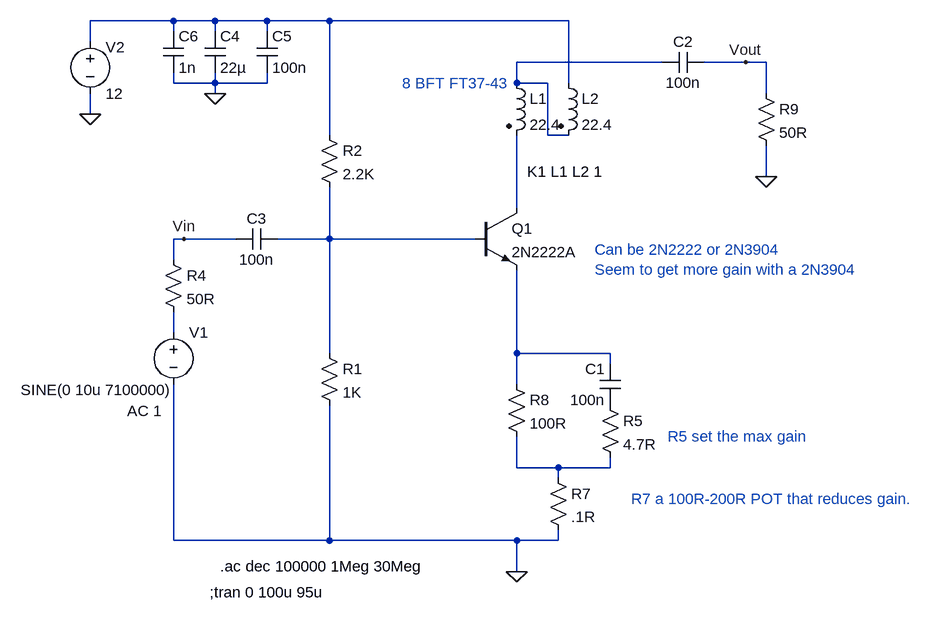
[diagram p0: schematic 2N2222 Preamp Testing.asc]
2N2222 Preamp Testing.asc, the LTspice schematic file:
Version 4
SHEET 1 2072 816
WIRE -208 -176 -336 -176
WIRE -144 -176 -208 -176
WIRE -64 -176 -144 -176
WIRE 32 -176 -64 -176
WIRE 400 -176 32 -176
WIRE -208 -160 -208 -176
WIRE -144 -160 -144 -176
WIRE -64 -160 -64 -176
WIRE -336 -144 -336 -176
WIRE 544 -112 320 -112
WIRE 672 -112 608 -112
WIRE 704 -112 672 -112
WIRE -208 -80 -208 -96
WIRE -144 -80 -144 -96
WIRE -144 -80 -208 -80
WIRE -64 -80 -64 -96
WIRE -64 -80 -144 -80
WIRE 320 -80 320 -112
WIRE 368 -80 320 -80
WIRE 400 -80 400 -176
WIRE -144 -64 -144 -80
WIRE 704 -64 704 -112
WIRE -336 -32 -336 -64
WIRE 32 0 32 -176
WIRE 368 0 368 -80
WIRE 400 0 368 0
WIRE 704 64 704 16
WIRE 320 112 320 0
WIRE -192 160 -208 160
WIRE -112 160 -192 160
WIRE 32 160 32 80
WIRE 32 160 -48 160
WIRE 256 160 32 160
WIRE -208 192 -208 160
WIRE -208 304 -208 272
WIRE 32 336 32 160
WIRE 320 336 320 208
WIRE 464 336 320 336
WIRE 464 352 464 336
WIRE 320 384 320 336
WIRE 320 512 320 464
WIRE 384 512 320 512
WIRE 464 512 464 496
WIRE 464 512 384 512
WIRE 384 528 384 512
WIRE -208 624 -208 384
WIRE 32 624 32 416
WIRE 32 624 -208 624
WIRE 320 624 32 624
WIRE 384 624 384 608
WIRE 384 624 320 624
WIRE 320 672 320 624
FLAG -336 -32 0
FLAG 320 672 0
FLAG -192 160 Vin
FLAG -144 -64 0
FLAG 704 64 0
FLAG 672 -112 Vout
SYMBOL npn 256 112 R0
SYMATTR InstName Q1
SYMATTR Value 2N2222A
SYMBOL voltage -208 288 R0
WINDOW 123 -71 137 Left 2
WINDOW 39 -107 169 Left 2
WINDOW 3 -235 104 Left 2
SYMATTR Value2 AC 1
SYMATTR Value SINE(0 10u 7100000)
SYMATTR InstName V1
SYMBOL res 16 320 R0
SYMATTR InstName R1
SYMATTR Value 1K
SYMBOL cap 480 416 R180
WINDOW 0 24 56 Left 2
WINDOW 3 24 8 Left 2
SYMATTR InstName C1
SYMATTR Value 100n
SYMBOL cap -48 144 R90
WINDOW 0 0 32 VBottom 2
WINDOW 3 32 32 VTop 2
SYMATTR InstName C3
SYMATTR Value 100n
SYMBOL voltage -336 -160 R0
WINDOW 0 24 25 Left 2
WINDOW 123 0 0 Left 2
WINDOW 39 0 0 Left 2
SYMATTR InstName V2
SYMATTR Value 12
SYMBOL ind2 304 -96 R0
SYMATTR InstName L1
SYMATTR Value 22.4
SYMATTR Type ind
SYMBOL ind2 384 -96 R0
SYMATTR InstName L2
SYMATTR Value 22.4
SYMATTR Type ind
SYMBOL res 304 368 R0
SYMATTR InstName R8
SYMATTR Value 100R
SYMBOL res -224 176 R0
SYMATTR InstName R4
SYMATTR Value 50R
SYMBOL cap -160 -160 R0
SYMATTR InstName C4
SYMATTR Value 22µ
SYMBOL res 16 -16 R0
SYMATTR InstName R2
SYMATTR Value 2.2K
SYMBOL cap -80 -160 R0
SYMATTR InstName C5
SYMATTR Value 100n
SYMBOL res 448 400 R0
SYMATTR InstName R5
SYMATTR Value 4.7R
SYMBOL res 688 -80 R0
SYMATTR InstName R9
SYMATTR Value 50R
SYMBOL cap 608 -128 R90
WINDOW 0 0 32 VBottom 2
WINDOW 3 32 32 VTop 2
SYMATTR InstName C2
SYMATTR Value 100n
SYMBOL res 368 512 R0
SYMATTR InstName R7
SYMATTR Value .1R
SYMBOL cap -224 -160 R0
SYMATTR InstName C6
SYMATTR Value 1n
TEXT 336 56 Left 2 !K1 L1 L2 1
TEXT -136 664 Left 2 !.ac dec 100000 1Meg 30Meg
TEXT -152 704 Left 2 !;tran 0 100u 95u
TEXT 496 560 Left 2 ;R7 a 100R-200R POT that reduces gain.
TEXT 440 176 Left 2 ;Can be 2N2222 or 2N3904\nSeem to get more gain with a 2N3904
TEXT 552 464 Left 2 ;R5 set the max gain
TEXT 144 -80 Left 2 ;8 BFT FT37-43

The netlist it stands for:
* 2N2222 Preamp Testing.asc
Q1 N003 N004 N006 0 2N2222A
V1 N005 0 SINE(0 10u 7100000) AC 1
R1 N004 0 1K
C1 P001 N006 100n
C3 N004 Vin 100n
V2 N001 0 12
L1 N002 N003 22.4
L2 N001 N002 22.4
R8 N006 N007 100R
R4 Vin N005 50R
C4 N001 0 22µ
R2 N001 N004 2.2K
C5 N001 0 100n
R5 P001 N007 4.7R
R9 Vout 0 50R
C2 Vout N002 100n
R7 N007 0 .1R
C6 N001 0 1n
.model NPN NPN
.model PNP PNP
.lib standard.bjt
K1 L1 L2 1
.ac dec 100000 1Meg 30Meg
;tran 0 100u 95u
* R7 a 100R-200R POT that reduces gain.
* Can be 2N2222 or 2N3904
* Seem to get more gain with a 2N3904
* R5 set the max gain
* 8 BFT FT37-43
.backanno
.end